# EAGLE design main (EAGLE 9.6.2)
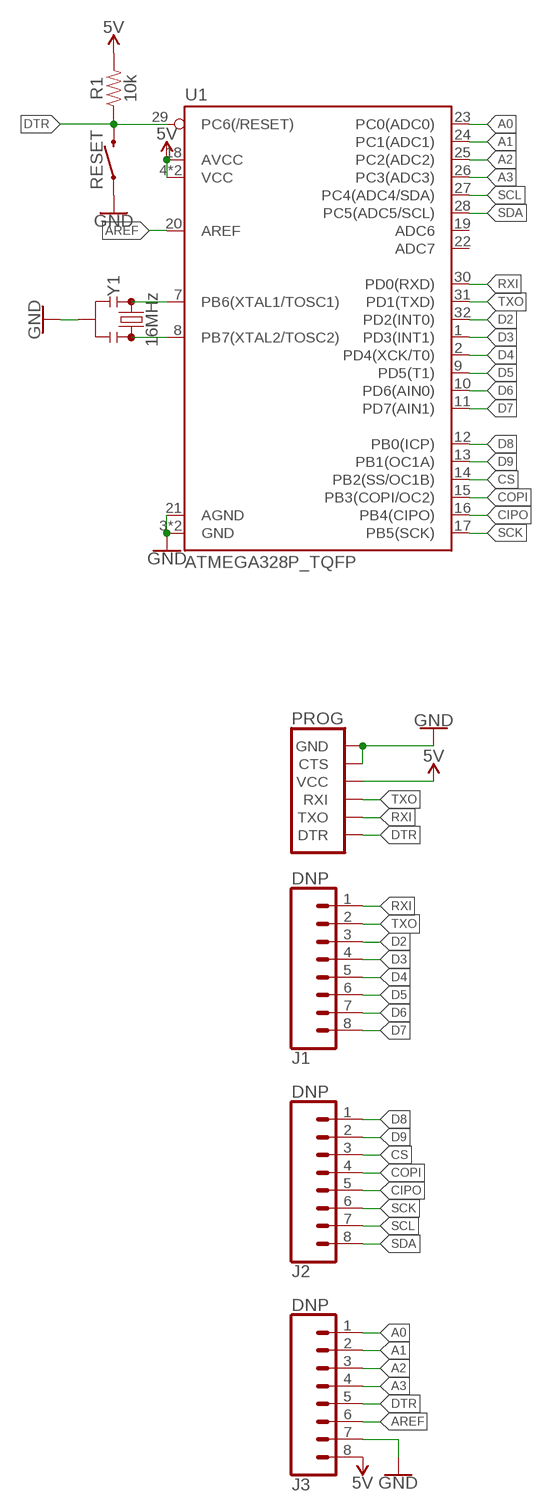
[diagram p0: schematic, sheet 1]

## Parts
J1  DNP  CONN_08"  [1X08]
J2  DNP  CONN_08"  [1X08]
J3  DNP  CONN_08"  [1X08]
PROG  6_PIN_SERIAL_TARGETSILK  [6_PIN_SERIAL_TARGET_SIDE_W_SILK]
R1  10k  10KOHM-0402-1/16W-1%  [0402]
RESET  MOMENTARY-SWITCH-SPST-SMD-6.0X3.5MM  [TACTILE_SWITCH_SMD_6.0X3.5MM]
U1  ATMEGA328P_TQFP  [TQFP32-08]
Y1  16MHz  RESONATOR-16MHZSMD_3.2X1.3  [RESONATOR-SMD-3.2X1.3]

## Nets
5V: J3.8 PROG.4(VCC) R1.2 U1.4(VCC) U1.6(VCC) U1.18(AVCC)
A0: J3.1 U1.23(PC0(ADC0))
A1: J3.2 U1.24(PC1(ADC1))
A2: J3.3 U1.25(PC2(ADC2))
A3: J3.4 U1.26(PC3(ADC3))
AREF: J3.6 U1.20(AREF)
CIPO: J2.5 U1.16(PB4(CIPO))
COPI: J2.4 U1.15(PB3(COPI/OC2))
CS: J2.3 U1.14(PB2(SS/OC1B))
D2: J1.3 U1.32(PD2(INT0))
D3: J1.4 U1.1(PD3(INT1))
D4: J1.5 U1.2(PD4(XCK/T0))
D5: J1.6 U1.9(PD5(T1))
D6: J1.7 U1.10(PD6(AIN0))
D7: J1.8 U1.11(PD7(AIN1))
D8: J2.1 U1.12(PB0(ICP))
D9: J2.2 U1.13(PB1(OC1A))
DTR: J3.5 PROG.1(DTR) R1.1 RESET.2 U1.29(PC6(/RESET))
GND: J3.7 PROG.5(CTS) PROG.6(GND) RESET.1 U1.3(GND) U1.5(GND) U1.21(AGND) Y1.2
N$1: U1.8(PB7(XTAL2/TOSC2)) Y1.3
N$2: U1.7(PB6(XTAL1/TOSC1)) Y1.1
RXI: J1.1 PROG.2(TXO) U1.30(PD0(RXD))
SCK: J2.6 U1.17(PB5(SCK))
SCL: J2.7 U1.27(PC4(ADC4/SDA))
SDA: J2.8 U1.28(PC5(ADC5/SCL))
TXO: J1.2 PROG.3(RXI) U1.31(PD1(TXD))
Unconnected: U1.19(ADC6) U1.22(ADC7)

## Library data of the parts
J1-J3 = SparkFun-Connectors:CONN_08: Multi connection point. Often used as Generic Header-pin footprint for 0.1 inch spaced/style header connections On any of the 0.1 inch spaced packages, you can populate with these: Break Away Headers - Straight <https://www.sparkfun.com/products/116> (PRT-00116) Break Away Male Headers - Right Angle <https://www.sparkfun.com/products/553> (PRT-00553) Female Headers <https://www.sparkfun.com/products/115> (PRT-00115) Break Away Headers - Machine Pin <https://www.sparkfun.com/products/117> (PRT-00117) Break Away Female Headers - Swiss Machine Pin <https://www.sparkfun.com/products/743> (PRT-00743) Arduino Stackable Header - 8 Pin <https://www.sparkfun.com/products/9279> (PRT-09279) For SCREWTERMINALS and SPRING TERMINALS visit here: Screw Terimnals on SparkFun.com <https://www.sparkfun.com/search/results?term=Screw+Terminals> (5mm/3.5mm/2.54mm spacing) This device is also useful as a general connection point to wire up your design to another part of your project. Our various solder wires solder well into these plated through hole pads. Hook-Up Wire - Assortment (Stranded, 22 AWG) <https://www.sparkfun.com/products/11375> (PRT-11375) Hook-Up Wire - Assortment (Solid Core, 22 AWG) <https://www.sparkfun.com/products/11367> (PRT-11367) View the entire wire category on our website here <https://www.sparkfun.com/categories/141> Special notes: Molex polarized connector foot print use with SKU : PRT-08231 with associated crimp pins and housings. 1MM SMD Version SKU: PRT-10208 NOTES ON THE VARIANTS LOCK and LOCK_LONGPADS... This footprint was designed to help hold the alignment of a through-hole component (i.e. 6-pin header) while soldering it into place. You may notice that each hole has been shifted either up or down by 0.005 of an inch from it's more standard position (which is a perfectly straight line). This slight alteration caused the pins (the squares in the middle) to touch the edges of the holes. Because they are alternating, it causes a "brace" to hold the component in place. 0.005 has proven to be the perfect amount of "off-center" position when using our standard breakaway headers. Although looks a little odd when you look at the bare footprint, once you have a header in there, the alteration is very hard to notice. Also,if you push a header all the way into place, it is covered up entirely on the bottom side.; PROD_ID: CONN-08438
PROG = SparkFun-Connectors:6_PIN_SERIAL_TARGET: 6-pin header connection for use with the "FTDI BASIC" pinout - TARGET SIDE. Also known as "Arduino Serial Program Header". It is used to mate with our FTDI Basic serial programmers using the Arduino IDE. Note, this device has "TARGET" in the name. It is intended to be used on a design that contains a target micro-controller that you wish to program. The "sister" device, named "CABLE" is inteneded to be used on a design that usually lives on the end of your USB cable and prvides the converter chip (FTDI232 or FTDI231x) to commnicate serial RX/TX. You can populate with some of these: Break Away Headers - Straight <https://www.sparkfun.com/products/116> (PRT-00116) For reference (or to suit your programming needs) check out these designs: SparkFun FTDI Basic Breakout - 5V <https://www.sparkfun.com/products/9716> (DEV-09716) SparkFun FTDI Basic Breakout - 3.3V <https://www.sparkfun.com/products/9873> (DEV-09873) SparkFun FTDI SmartBasic <https://www.sparkfun.com/products/12935> (DEV-12935) SparkFun Beefy 3 - FTDI Basic Breakout <https://www.sparkfun.com/products/13746> (DEV-13746)
R1 = SparkFun-Resistors:10KOHM: 10kΩ resistor A resistor is a passive two-terminal electrical component that implements electrical resistance as a circuit element. Resistors act to reduce current flow, and, at the same time, act to lower voltage levels within circuits. - Wikipedia; PROD_ID: RES-14241
RESET = SparkFun-Switches:MOMENTARY-SWITCH-SPST: Momentary Switch (Pushbutton) - SPST Normally-open (NO) SPST momentary switches (buttons, pushbuttons). Variants PTH-12MM - 12mm square, through-hole Momentary Pushbutton Switch - 12mm Square <https://www.sparkfun.com/products/9190> (COM-09190) PTH-6.0MM, PTH-6.0MM-KIT - 6.0mm square, through-hole Mini Pushbutton Switch <https://www.sparkfun.com/products/97> (COM-00097) KIT package intended for soldering kit's - only one side of pads' copper is exposed. PTH-RIGHT-ANGLE-KIT - Right-angle, through-hole Right Angle Tactile Button <https://www.sparkfun.com/products/10791> - Used on SparkFun BigTime Watch Kit <https://www.sparkfun.com/products/11734> SMD-12MM - 12mm square, surface-mount Tactile Button - SMD (12mm) <https://www.sparkfun.com/products/12993> (COM-12993) Used on SparkFun PicoBoard <https://www.sparkfun.com/products/11888> SMD-4.5MM - 4.5mm Square Trackball Switch Used on SparkFun Blackberry Trackballer Breakout <https://www.sparkfun.com/products/13169> SMD-4.6MMX2.8MM - 4.60mm x 2.80mm, surface mount Used on SparkFun Pro Micro - RP2040 <https://www.sparkfun.com/products/17717> SMD-5.2MM, SMD-5.2-REDUNDANT - 5.2mm square, surface-mount Mini Pushbutton Switch - SMD <https://www.sparkfun.com/products/8720> (COM-08720) Used on Arduino Pro Mini <https://www.sparkfun.com/products/11114> REDUNDANT package connects both switch circuits together SMD-6.0X3.5MM - 6.0 x 3.5mm, surface mount Momentary Reset Switch SMD <https://www.sparkfun.com/products/8229> (COM-08229) SMD-6.2MM-TALL - 6.2mm square, surface mount Tactile Button - SMD (6mm) <https://www.sparkfun.com/products/12992> Used on SparkFun Digital Sandbox <https://www.sparkfun.com/products/12651> SMD-RIGHT-ANGLE - Right-angle, surface mount Used on SparkFun Block for Intel® Edison - Arduino <https://www.sparkfun.com/products/13036>; PROD_ID: SWCH-14278; SF_SKU: COM-08229
U1 = SparkFun-IC-Microcontroller:ATMEGA328P_TQFP: Popular 328P in QFP Storefront component: ATmega328 - TQFP <https://www.sparkfun.com/products/13448> (COM-13448) Datasheet <http://www.sparkfun.com/datasheets/Components/SMD/ATMega328.pdf> SparkFun Products SparkFun RedBoard - Programmed with Arduino <https://www.sparkfun.com/products/12757> (DEV-12757) Arduino Pro Mini 328 - 5V/16MHz <https://www.sparkfun.com/products/11113> (DEV-11113) Arduino Pro Mini 328 - 3.3V/8MHz <https://www.sparkfun.com/products/11114> (DEV-11114) SparkFun OpenLog <https://www.sparkfun.com/products/13712> (DEV-13712) SparkFun MicroView - OLED Arduino Module <https://www.sparkfun.com/products/12923> (DEV-12923) SparkFun Digital Sandbox <https://www.sparkfun.com/products/12651> (DEV-12651) SparkFun PicoBoard <https://www.sparkfun.com/products/11888> (WIG-11888) Arduino Fio <https://www.sparkfun.com/products/10116> (DEV-10116) LilyPad Arduino 328 Main Board <https://www.sparkfun.com/products/13342> (DEV-13342) SparkFun RedStick <https://www.sparkfun.com/products/13741> (DEV-13741) LilyPad MP3 <https://www.sparkfun.com/products/11013> (DEV-11013) LilyPad Arduino SimpleSnap <https://www.sparkfun.com/products/10941> (DEV-10941) SparkFun Stepoko <https://www.sparkfun.com/products/13899> (ROB-13899) SparkFun Geiger Counter <https://www.sparkfun.com/products/11345> (SEN-11345) SparkFun EL Sequencer <https://www.sparkfun.com/products/12781> (COM-12781) Arduino Pro 328 - 5V/16MHz <https://www.sparkfun.com/products/10915> (DEV-10915) CryptoCape <https://www.sparkfun.com/products/12773> (DEV-12773) SparkFun IR Thermometer Evaluation Board - MLX90614 <https://www.sparkfun.com/products/10740> (SEN-10740) SparkFun RedBot Mainboard <https://www.sparkfun.com/products/12097> (ROB-12097) Arduino Pro 328 - 3.3V/8MHz <https://www.sparkfun.com/products/10914> (DEV-10914) SparkFun Block for Intel® Edison - Arduino <https://www.sparkfun.com/products/13036> (DEV-13036) SparkFun Simon Says - Surface Mount Soldering Kit <https://www.sparkfun.com/products/10935> (KIT-10935) SparkFun 7-Segment Serial Display - Red <https://www.sparkfun.com/products/11441> (COM-11441) SparkFun 7-Segment Serial Display - White <https://www.sparkfun.com/products/11629> (COM-11629) SparkFun 7-Segment Serial Display - Yellow <https://www.sparkfun.com/products/11443> (COM-11443) SparkFun 7-Segment Serial Display - Kelly Green <https://www.sparkfun.com/products/11440> (COM-11440) SparkFun 7-Segment Serial Display - Blue <https://www.sparkfun.com/products/11442> (COM-11442) SparkFun OpenSegment Serial Display - 20mm (Blue) <https://www.sparkfun.com/products/11647> (COM-11647) SparkFun OpenSegment Serial Display - 20mm (Green) <https://www.sparkfun.com/products/11646> (COM-11646) SparkFun OpenSegment Serial Display - 20mm (White) <https://www.sparkfun.com/products/11648> (COM-11648) SparkFun OpenSegment Serial Display - 20mm (Red) <https://www.sparkfun.com/products/11644> (COM-11644) SparkFun OpenSegment Serial Display - 20mm (Yellow) <https://www.sparkfun.com/products/11645> (COM-11645) SparkFun OpenSegment Shield <https://www.sparkfun.com/products/13190> (DEV-13190); PROD_ID: IC-09069
Y1 = SparkFun-Clocks:RESONATOR-16MHZ: 16MHz Resonator Digikey Example <http://www.digikey.com/product-detail/en/murata-electronics-north-america/CSTCE16M0V53-R0/490-1198-1-ND/584635> Frequency: 16MHz Frequency Stability: ±0.3% Frequency Tolerance: ±0.5% Capacitance: 15pF SparkFun Products SparkFun OpenLog <https://www.sparkfun.com/products/13712> SparkFun MicroView - OLED Arduino Module <https://www.sparkfun.com/products/12923>; PROD_ID: XTAL-08900

## Board
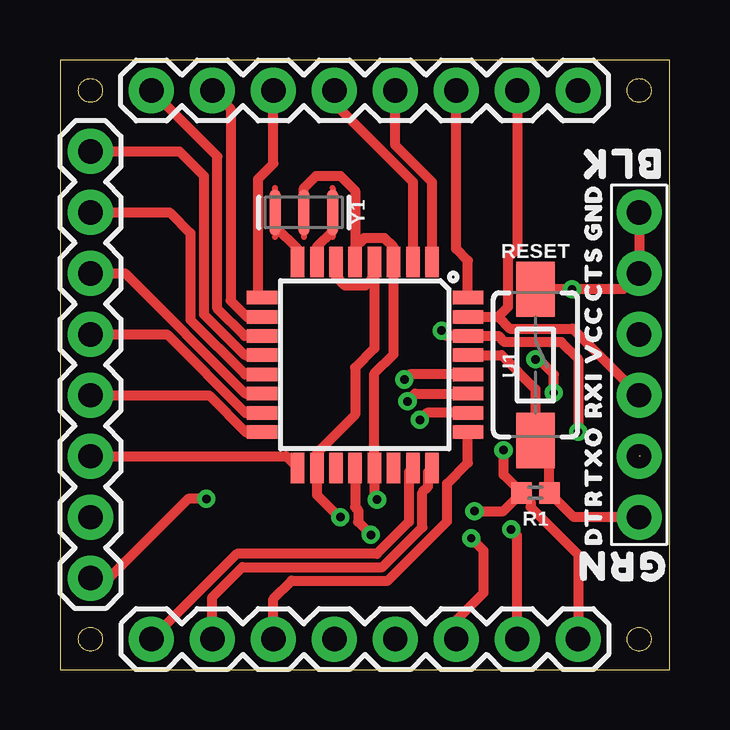
[diagram p1: board, top side]
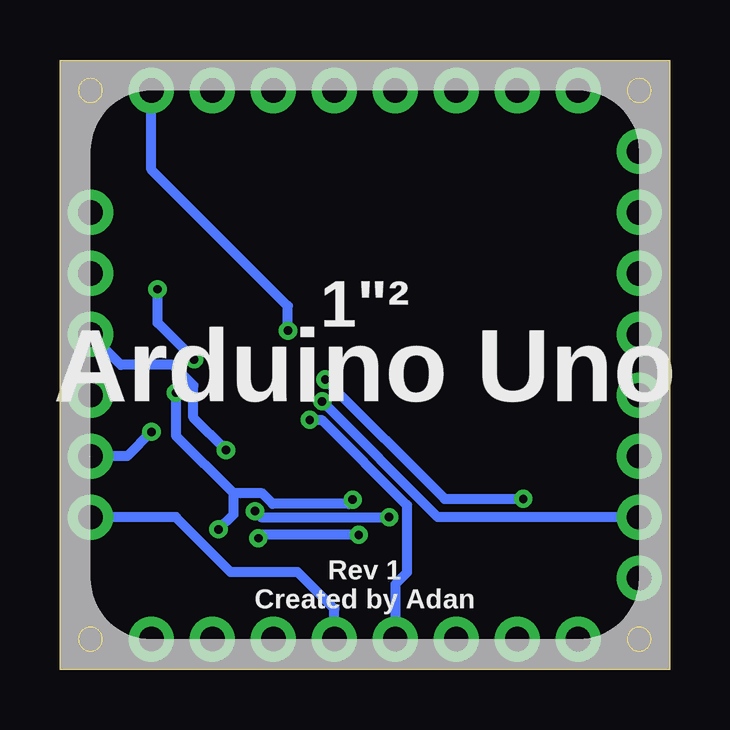
[diagram p2: board, bottom side, seen from below]

Size 25.4 x 25.4 mm. Coordinates in mm from the lower left corner, seen from the top.
Outline: 25.4,0 25.4,25.4 0,25.4 0,0 25.4,0
Outline: 1.77,1.27 arc-180 0.77,1.27 arc-180 1.77,1.27
Outline: 24.63,1.27 arc-180 23.63,1.27 arc-180 24.63,1.27
Outline: 24.63,24.13 arc-180 23.63,24.13 arc-180 24.63,24.13
Outline: 1.77,24.13 arc-180 0.77,24.13 arc-180 1.77,24.13
Copper layers (1*16): Top 0.035mm / dielectric 1.5mm / Bottom 0.035mm
Design rules "default": minimum track width 6mil, minimum drill 0.35mm, track to track 6mil, track to pad 6mil, pad to pad 6mil, via to via 6mil, smd to smd 6mil, copper to edge 40mil, drill to drill 6mil, minimum pad ring 10mil, minimum via ring 8mil, stop-mask expansion 4mil, vias tented up to drill 0mil, thermal gap 10mil

### Footprints (pad centres in the part's own frame; a part is rotated, then mirrored left to right if it is on the bottom)
1X08 = drill 1.016 pad 1.88: 1 0,0; 2 2.54,0; 3 5.08,0; 4 7.62,0; 5 10.16,0; 6 12.7,0; 7 15.24,0; 8 17.78,0
6_PIN_SERIAL_TARGET_SIDE_W_SILK = drill 1.016 pad 1.88: 1 -6.35,0; 2 -3.81,0; 3 -1.27,0; 4 1.27,0; 5 3.81,0; 6 6.35,0
0402 = smd 0.85 x 0.9: 1 -0.58,0; 2 0.58,0
TACTILE_SWITCH_SMD_6.0X3.5MM = smd 2.3 x 1.6: 1 -3.15,0; 2 3.15,0
TQFP32-08 = smd 1.27 x 0.559: 1 -4.293,2.8; 2 -4.293,2; 3 -4.293,1.2; 4 -4.293,0.4; 5 -4.293,-0.4; 6 -4.293,-1.2; 7 -4.293,-2; 8 -4.293,-2.8; 17 4.293,-2.8; 18 4.293,-2; 19 4.293,-1.2; 20 4.293,-0.4; 21 4.293,0.4; 22 4.293,1.2; 23 4.293,2; 24 4.293,2.8 | smd 0.559 x 1.27: 9 -2.8,-4.293; 10 -2,-4.293; 11 -1.2,-4.293; 12 -0.4,-4.293; 13 0.4,-4.293; 14 1.2,-4.293; 15 2,-4.293; 16 2.8,-4.293; 25 2.8,4.293; 26 2,4.293; 27 1.2,4.293; 28 0.4,4.293; 29 -0.4,4.293; 30 -1.2,4.293; 31 -2,4.293; 32 -2.8,4.293
RESONATOR-SMD-3.2X1.3 = smd 0.45 x 1.905: 1 -1.2,0; 2 0,0; 3 1.2,0

### Placement (x,y rotation side)
J1  21.59,24.13 180 top
J2  1.27,21.59 270 top
J3  3.81,1.27 0 top
PROG  24.13,12.7 90 top
R1  19.81,7.37 180 top
RESET  19.81,12.7 270 top
U1  12.7,12.7 270 top
Y1  10.16,19.05 180 top

### Tracks (layer width: path | path; a pad name or v marks a point on that pad's centre or on a via)
5V  (via drill 0.35)
  Top 0.406: U1.6 11.5,16.38 11.87,16 12.73,16 13.1,16.38 U1.4 13.1,13.38 12.3,12.58 12.3,10.62 10.7,9.03 U1.18 10.7,7.28 11.63,6.35 v11.68,6.35 | R1.2 18.47,6.6 v17.27,6.6 | R1.2 18.48,8.12 v18.48,9.14 | R1.2 19.61,6.99 19.61,6.77 21.59,4.79 J3.8
  Bottom 0.406: v18.48,9.14 19.84,10.5 19.84,11.84 20.7,12.7 22.86,12.7 PROG.4 | v11.68,6.35 17.02,6.35 v17.27,6.6
A0
  Top 0.406: U1.23 14.54,8.24 14.54,6.16 13.2,4.83 7.37,4.83 J3.1
A1
  Top 0.406: J3.2 6.35,3.02 7.6,4.27 13.43,4.27 15.09,5.93 15.09,7.38 15.34,7.62 15.34,8.24 U1.24
A2
  Top 0.406: J3.3 8.89,2.95 9.65,3.71 13.66,3.71 16.14,6.18 16.14,7.75 16.99,8.61 U1.25
A3  (via drill 0.35)
  Top 0.406: U1.26 15.29,10.7 v14.99,10.41
  Bottom 0.406: v14.99,10.41 14.5,10.41 10.95,6.86 10.95,4.04 11.43,3.56 J3.4
AREF  (via drill 0.35)
  Top 0.406: U1.20 12.3,6.77 12.42,6.65 12.42,6.15 v12.95,5.62 | v17.13,5.47 17.64,4.96 17.64,3.19 16.51,2.05 J3.6
  Bottom 0.406: v12.95,5.62 16.99,5.62 v17.13,5.47
CIPO
  Top 0.406: J2.5 6.21,11.43 7.74,9.9 U1.16
COPI
  Top 0.406: J2.4 4.46,13.97 7.73,10.7 U1.15
CS
  Top 0.406: J2.3 2.71,16.51 7.72,11.5 U1.14
D2
  Top 0.406: U1.32 16.99,17.04 16.51,17.53 J1.3
D3
  Top 0.406: U1.1 15.5,20.31 13.97,21.84 J1.4
D4
  Top 0.406: J1.5 11.43,23.59 14.7,20.32 U1.2
D5
  Top 0.406: U1.9 8.26,15.65 8.26,20.45 8.89,21.08 J1.6
D6
  Top 0.406: J1.7 7.11,23.37 7.11,15.38 7.79,14.7 U1.10
D7
  Top 0.406: U1.11 7.69,13.9 6.55,15.04 6.55,21.39 J1.8
D8
  Top 0.406: J2.1 4.98,21.59 5.99,20.57 5.99,14.8 7.7,13.1 U1.12
D9
  Top 0.406: J2.2 4.57,19.05 5.44,18.19 5.44,14.57 7.71,12.3 U1.13
DTR
  Top 0.406: 19.81,8.89 RESET.2 | PROG.1 21.41,6.35 R1.1 20.39,8.97 RESET.2 | U1.29 18.4,13.1 19.81,11.68 RESET.2
  Bottom 0.406: PROG.1 20.57,6.35 18.29,4.06 15.49,4.06 13.97,2.54 J3.5
GND  (via drill 0.35)
  Top 0.406: 10.16,19.81 Y1.2 10.16,20.07 10.67,20.57 11.68,20.57 12.3,19.96 U1.5 12.3,17.61 12.67,17.98 13.53,17.98 13.9,17.61 U1.3 13.9,13.14 13.1,12.34 U1.21 13.1,7.19 v13.21,7.08 | 19.81,15.01 RESET.1 v21.34,15.85 23.47,15.85 PROG.5 PROG.6 | v20.57,11.54 20.57,12.3 19.95,12.93 v19.81,12.93 | J3.7 19.05,5.59 v18.8,5.84
  Bottom 0.406: v20.57,11.54 20.57,9.75 18.17,7.34 | v19.81,12.93 21.34,14.45 v21.34,15.85 | 18.17,7.34 16.97,7.34 16.54,6.91 13.38,6.91 v13.21,7.08 | v18.8,5.84 18.17,6.47 18.17,7.34
N$1
  Top 0.152: Y1.3 8.96,18.47 9.02,18.41
  Top 0.406: U1.8 9.9,17.53 9.02,18.41
N$2
  Top 0.406: Y1.1 11.36,18.27 10.7,17.61 U1.7
RXI  (via drill 0.35)  (1 unrouted)
  Top 0.406: v21.59,9.91 21.59,12.95 20.89,13.65 18.52,13.65 18.26,13.9 U1.30 16.13,13.9 v15.9,14.12
  Bottom 0.406: v21.59,9.91 22.61,8.89 24.18,8.89 | v15.9,14.12 15.9,15.14 21.59,20.83 J1.1
SCK
  Top 0.406: J2.6 9.42,8.89 U1.17
SCL  (via drill 0.35)
  Top 0.406: v14.48,11.18 14.8,11.5 U1.27
  Bottom 0.406: J2.7 9.65,6.35 v14.48,11.18
SDA  (via drill 0.35)
  Top 0.406: U1.28 14.56,12.3 v14.35,12.09 | v6.1,7.11 5.33,7.11 2.03,3.81 J2.8
  Bottom 0.406: v14.35,12.09 9.38,7.11 v6.1,7.11
TXO
  Top 0.406: 16.96,14.73 U1.31 18.25,14.7 | 18.25,14.7 18.75,14.21 21.36,14.21 PROG.3 | 18.25,14.7 18.66,15.1 18.66,17.15 19.05,17.54 J1.2

### Text on the board
bNames: 1"² | Arduino Uno | Rev 1 / Created by Adan